# Altium project Copy of MB1180.PrjPCB
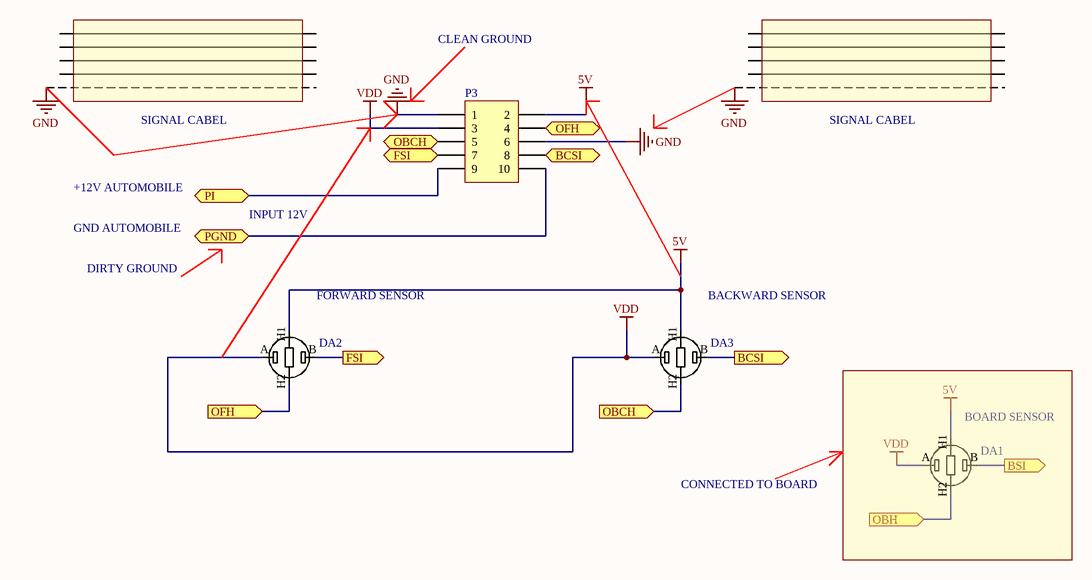
[diagram p0: sensor.SchDoc]
2 sheets, 5 parts. Net scope: flat (ports and power ports of the same name join across sheets).
Board file: MB1180.PcbDoc
Sheets:
  sensor.SchDoc
  programm socket.SchDoc

## Sheet sensor.SchDoc
size A4

### Parts
DA1  Gas sensor MQ4  [MQ1]  (value not drawn)
DA2  Gas sensor MQ4  [MQ1]  (value not drawn)
DA3  Gas sensor MQ4  [MQ1]  (value not drawn)
P3  Header 5X2  [HDR2X5]  (value not drawn)

### Blocks framed on the sheet
BOARD SENSOR: DA1

### Ports
BCSI (out), BSI (out), FSI (out), OBCH (in), OBCH (out), OBH (in), OFH (in), OFH (out), PGND (bidir), PI (bidir)

### Nets
5V: DA1.H1 DA2.H1 DA3.H1 P3.2
GND: P3.1 P3.6
VDD: DA1.A DA2.A DA3.A P3.3
NetDA1_B: DA1.B ; port BSI
NetDA1_H2: DA1.H2 ; port OBH
NetDA2_B: DA2.B P3.7 ; port FSI
NetDA2_H2: DA2.H2 P3.4 ; port OFH
NetDA3_B: DA3.B P3.8 ; port BCSI
NetDA3_H2: DA3.H2 P3.5 ; port OBCH
NetP3_9: P3.9 ; port PI
NetP3_10: P3.10 ; port PGND

### Notes on the sheet
- CLEAN GROUND
- SIGNAL CABEL
- +12V AUTOMOBILE
- GND AUTOMOBILE
- INPUT 12V
- DIRTY GROUND
- (near DA2) FORWARD SENSOR
- (near DA3) BACKWARD SENSOR
- CONNECTED TO BOARD
- Labels drawn without touching a wire or pin: GND

### Library data of the parts
DA1-DA3 = MQ1
P3 = Header 5X2: Header, 5-Pin, Dual row; LatestRevisionDate: 17-Jul-2002; LatestRevisionNote: Re-released for DXP Platform.; Publisher: Altium Limited

## Sheet programm socket.SchDoc
size A4
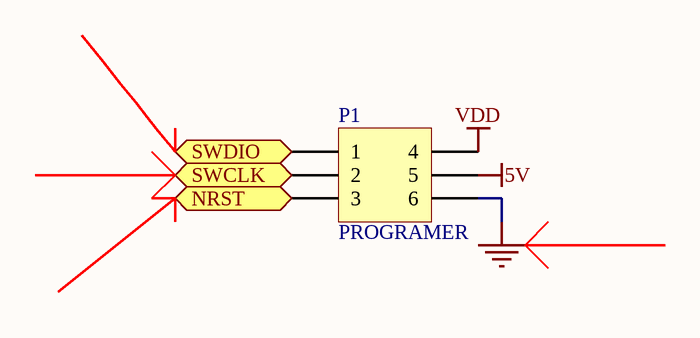
[diagram p1: programm socket.SchDoc]

### Parts
P1  PROGRAMER  [HDR2X3_CEN]

### Ports
NRST, SWCLK, SWDIO

### Nets
5V: P1.5
GND: P1.6
VDD: P1.4
NetP1_1: P1.1 ; port SWDIO
NetP1_2: P1.2 ; port SWCLK
NetP1_3: P1.3 ; port NRST

### Library data of the parts
P1 = Header 3X2A: Header, 3-Pin, Dual row; LatestRevisionDate: 17-Jul-2002; LatestRevisionNote: Re-released for DXP Platform.; Publisher: Altium Limited

## Nets that join several sheets
5V: sensor (DA1.H1 DA2.H1 DA3.H1 P3.2), programm socket (P1.5)
GND: sensor (P3.1 P3.6), programm socket (P1.6)
VDD: sensor (DA1.A DA2.A DA3.A P3.3), programm socket (P1.4)